# Altium project Wolf-Lite.PrjPcb (part 2 of 2)

## Sheet WL-CONNECT.SchDoc
size 420 x 297 mm; Address1: Address1; Address2: Address2; Address3: Address3; Address4: Address4; DocumentNumber: Wolf-Lite; SheetNumber: 12; Scale: 1:1; DocumentType: Схема электрическая принципиальная; FirstReferrence: АБВГ.123456.001
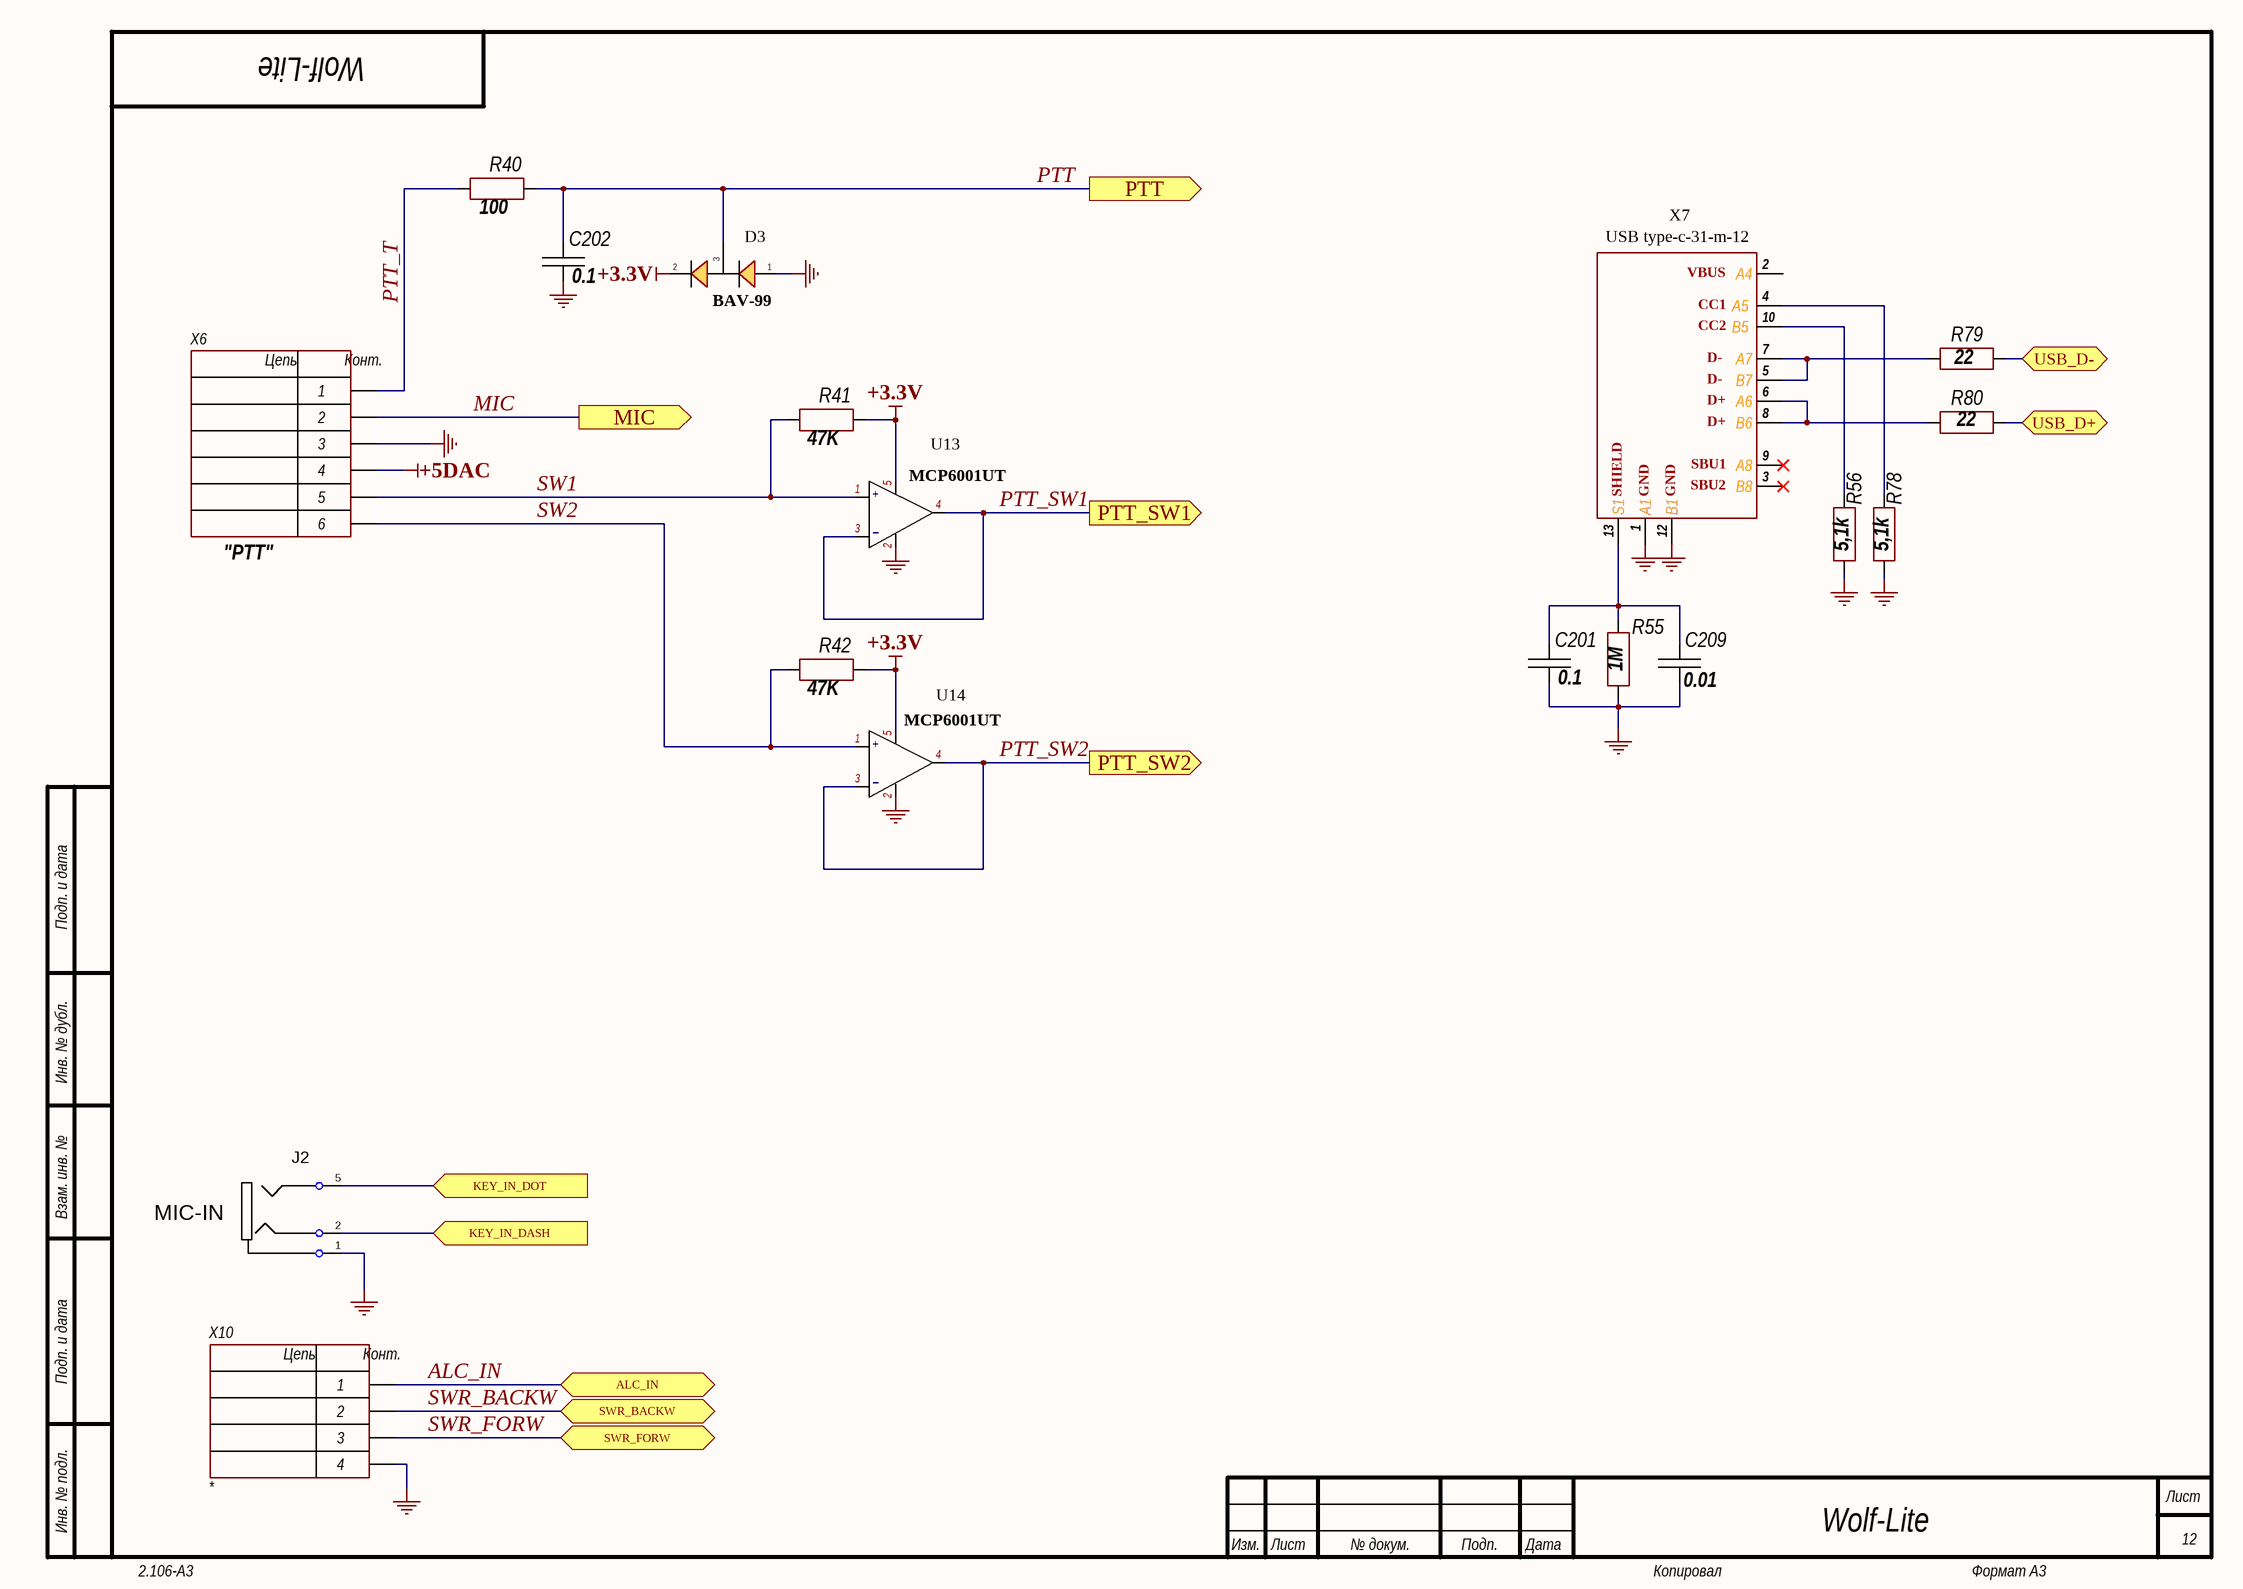
[diagram p10: WL-CONNECT.SchDoc]

### Parts
C201  0.1  [CH0805C]
C202  0.1  [CH0805C]
C209  0.01  [CH0805C]
D3  BAV-99  [SOT23_132]
J2  value MIC-IN  [3.5-stereo]  (hidden comment: SJ1-3525NG)
R40  100  [CH0805R]
R41  47K  [CH0805R]
R42  47K  [CH0805R]
R55  1M  [CH0805R]
R56  5,1k  [CH0805R]
R78  5,1k  [CH0805R]
R79  22  [CH0805R]
R80  22  [CH0805R]
U13  MCP6001UT  [SOT23-5]
U14  MCP6001UT  [SOT23-5]
X6  "PTT"  [RJ25-6pin]
X7  USB type-c-31-m-12  [TYPE-C-31-M-12_V1]
X10  *  [CON: PLS-4]

### Ports
ALC_IN (bidir), KEY_IN_DASH (in), KEY_IN_DOT (in), MIC (out), PTT (out), PTT_SW1 (out), PTT_SW2 (out), SWR_BACKW (bidir), SWR_FORW (bidir), USB_D+ (bidir), USB_D- (bidir)

### Nets
+3.3V: D3.2 R41.2 R42.2 U13.5 U14.5
+5DAC: X6.4
GND: C201.1 C202.1 C209.1 D3.1 J2.1 R55.1 R56.1 R78.1 U13.2 U14.2 X6.3 X7.1(A1) X7.12(B1) X10.4
ALC_IN: X10.1 ; port ALC_IN
KEY_IN_DASH: J2.2 ; port KEY_IN_DASH
KEY_IN_DOT: J2.5 ; port KEY_IN_DOT
MIC: X6.2 ; port MIC
PTT: C202.2 D3.3 R40.2 ; port PTT
PTT_SW1: U13.3 U13.4 ; port PTT_SW1
PTT_SW2: U14.3 U14.4 ; port PTT_SW2
PTT_T: R40.1 X6.1
SW1: R41.1 U13.1 X6.5
SW2: R42.1 U14.1 X6.6
SWR_BACKW: X10.2 ; port SWR_BACKW
SWR_FORW: X10.3 ; port SWR_FORW
USB_D+: R80.2 ; port USB_D+
USB_D-: R79.2 ; port USB_D-
NetC201_2: C201.2 C209.2 R55.2 X7.13(S1)
NetR56_2: R56.2 X7.10(B5)
NetR78_2: R78.2 X7.4(A5)
NetR79_1: R79.1 X7.5(B7) X7.7(A7)
NetR80_1: R80.1 X7.6(A6) X7.8(B6)

Not connected (* = marked no-connect by the designer): X7 2(A4) 3(B8)* 9(A8)*

### Notes on the sheet
- Подп. и дата
- Инв. № дубл.
- Взам. инв. №
- Инв. № подл.
- Изм.
- Лист
- № докум.
- Подп.
- Дата
- 2.106-A3
- Копировал
- Формат А3
- (in symbol 4-Connector) Цепь; Конт.
- (in symbol 6-Connector) Цепь; Конт.
- (in symbol MCP6001UT_1) +; -
- (in symbol USB-C_2.0) VBUS; CC1; CC2; D-; D+; SBU1; SHIELD; GND; SBU2

### Library data of the parts
C201 C202 C209 = Capacitor: Manufacturer: *; Model: *; HelpURL: *; ComponentKind: *; Value: *
J2 = SJ1-3523N
R40-R42 R55 R56 R78-R80 = Resistor: Manufacturer: *; Model: *; HelpURL: *; ComponentKind: *; Value: *
U13 U14 = MCP6001UT_1
X6 = 6-Connector: Model: *; Manufacturer: *; HelpURL: *; ComponentKind: *
X7 = USB-C_2.0
X10 = 4-Connector: Model: *; Manufacturer: *; HelpURL: *; ComponentKind: *

## Sheet WL-BPF_L.SchDoc
size 420 x 297 mm; Address1: Address1; Address2: Address2; Address3: Address3; Address4: Address4; DocumentNumber: Wolf-Lite; SheetNumber: 11; Scale: 1:1; DocumentType: Схема электрическая принципиальная; FirstReferrence: АБВГ.123456.001
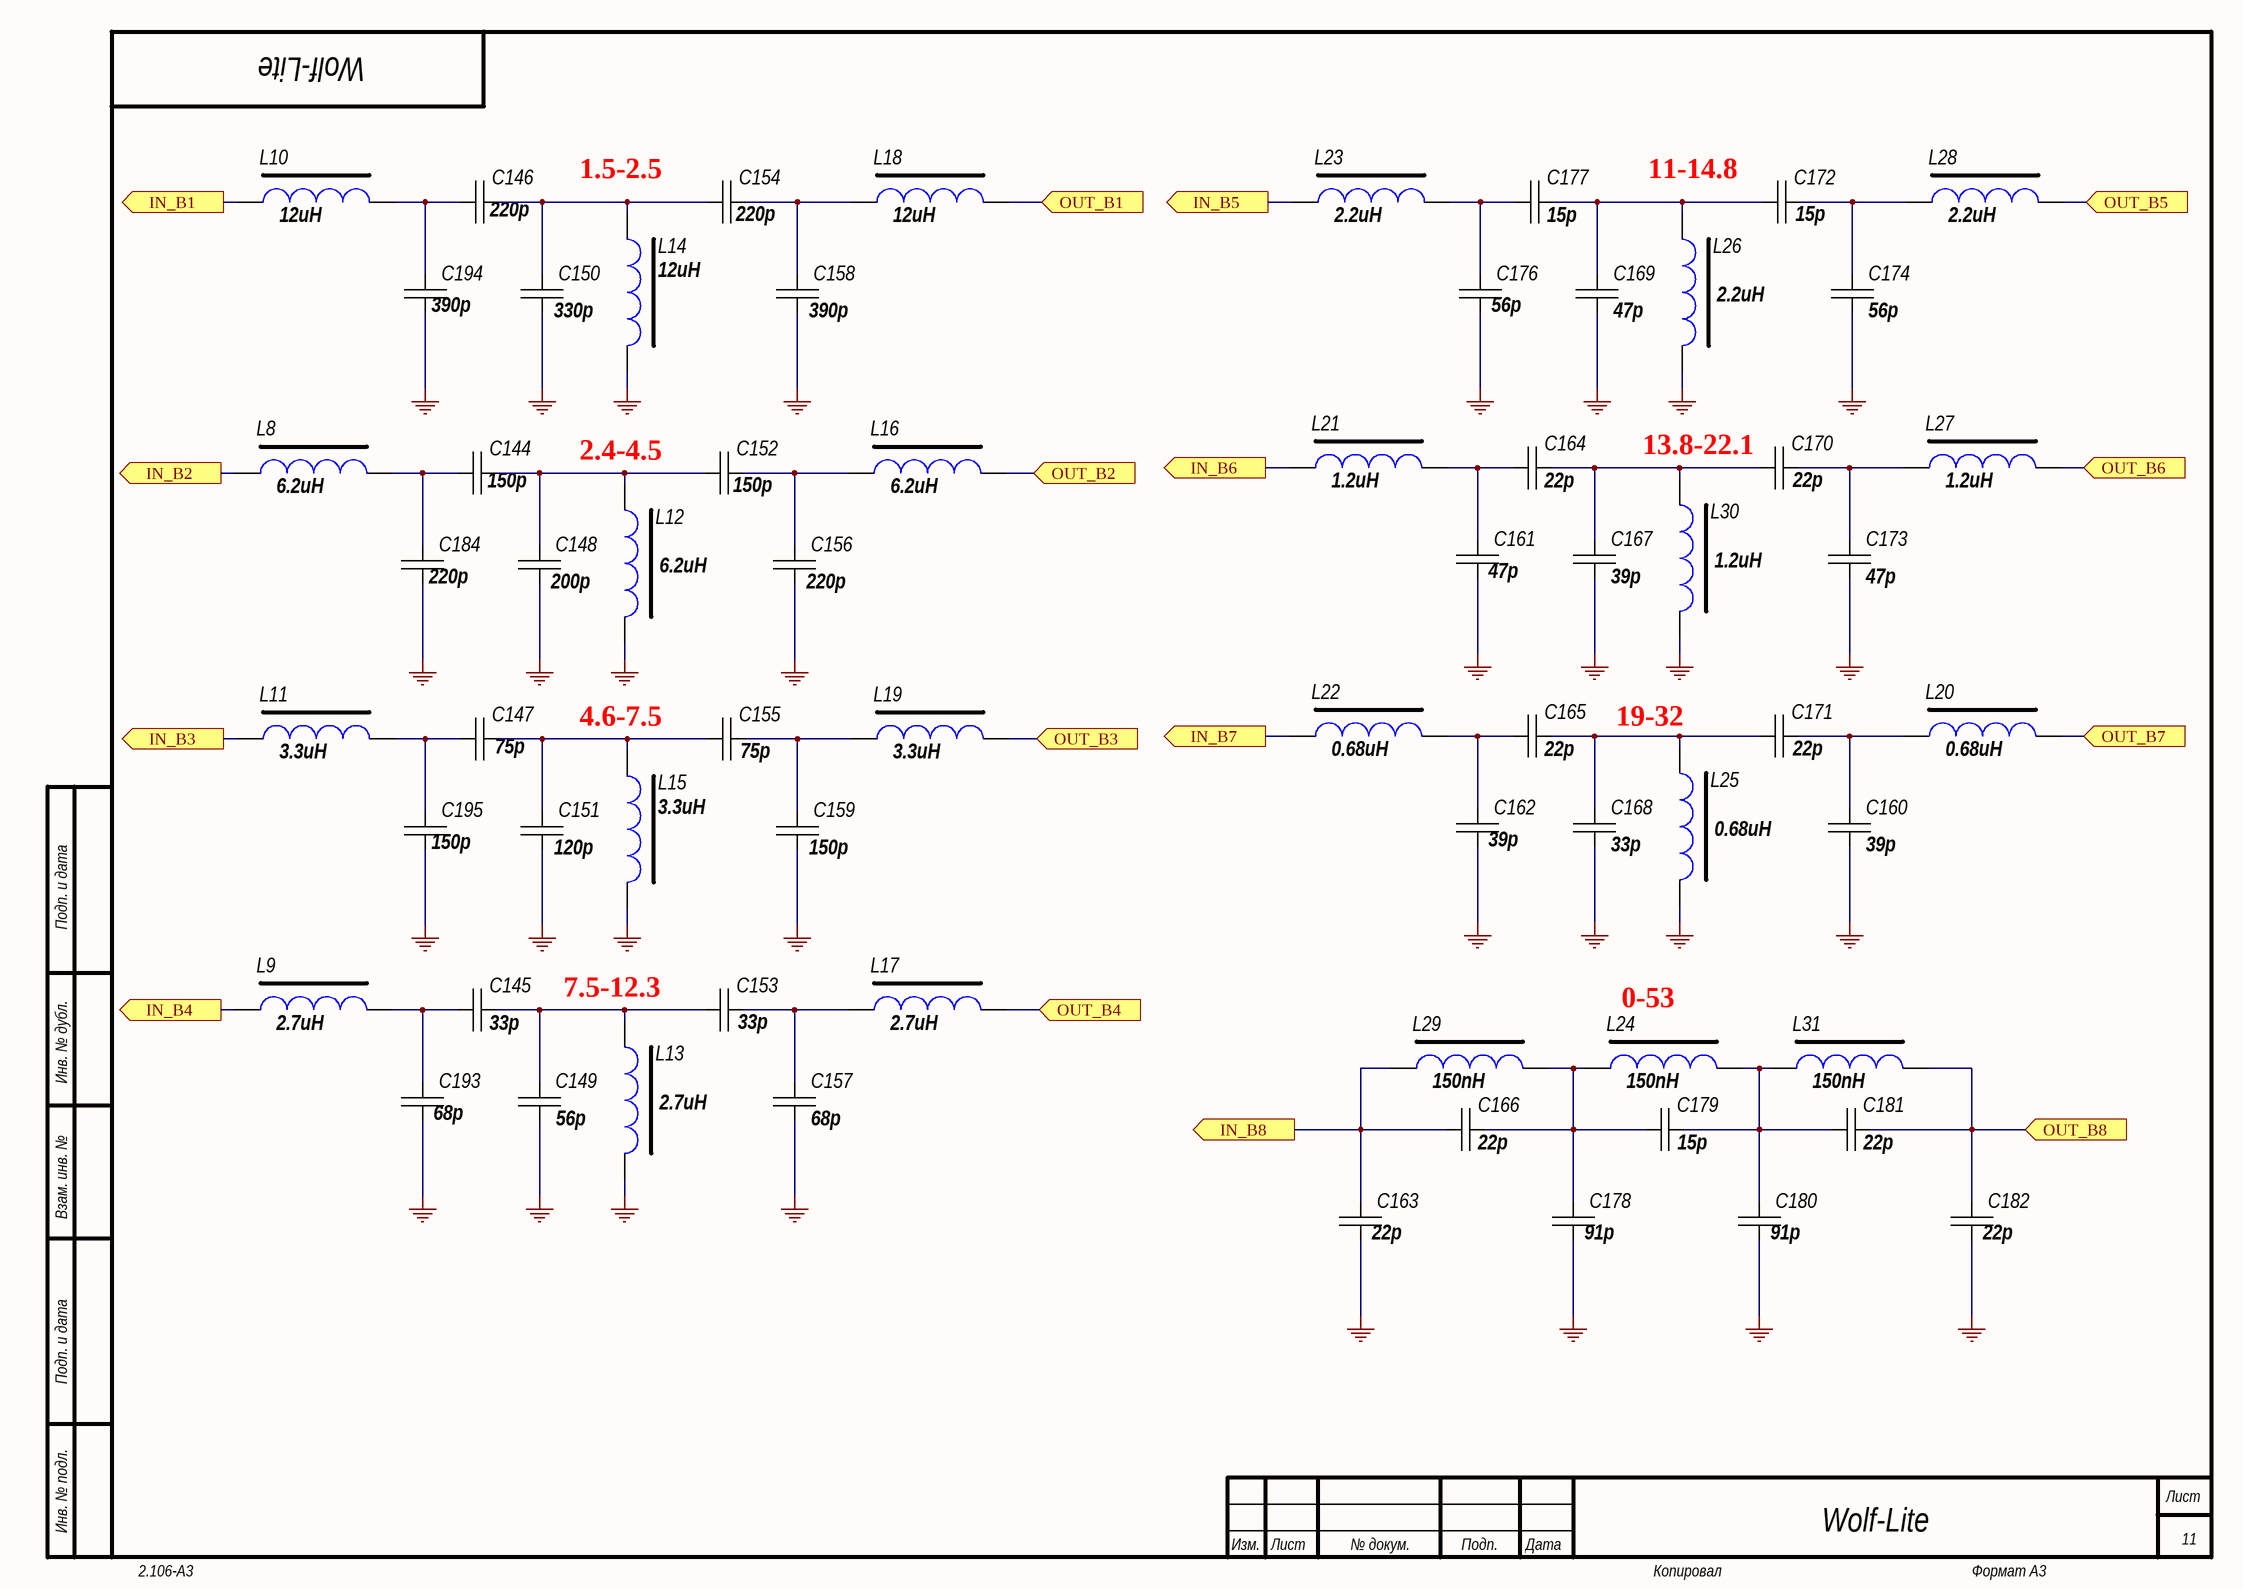
[diagram p11: WL-BPF_L.SchDoc]

### Parts
C144  150p  [CH0805C]
C145  33p  [CH0805C]
C146  220p  [CH0805C]
C147  75p  [CH0805C]
C148  200p  [CH0805C]
C149  56p  [CH0805C]
C150  330p  [CH0805C]
C151  120p  [CH0805C]
C152  150p  [CH0805C]
C153  33p  [CH0805C]
C154  220p  [CH0805C]
C155  75p  [CH0805C]
C156  220p  [CH0805C]
C157  68p  [CH0805C]
C158  390p  [CH0805C]
C159  150p  [CH0805C]
C160  39p  [CH0805C]
C161  47p  [CH0805C]
C162  39p  [CH0805C]
C163  22p  [CH0805C]
C164  22p  [CH0805C]
C165  22p  [CH0805C]
C166  22p  [CH0805C]
C167  39p  [CH0805C]
C168  33p  [CH0805C]
C169  47p  [CH0805C]
C170  22p  [CH0805C]
C171  22p  [CH0805C]
C172  15p  [CH0805C]
C173  47p  [CH0805C]
C174  56p  [CH0805C]
C176  56p  [CH0805C]
C177  15p  [CH0805C]
C178  91p  [CH0805C]
C179  15p  [CH0805C]
C180  91p  [CH0805C]
C181  22p  [CH0805C]
C182  22p  [CH0805C]
C184  220p  [CH0805C]
C193  68p  [CH0805C]
C194  390p  [CH0805C]
C195  150p  [CH0805C]
L8  6.2uH  [L1210]
L9  2.7uH  [L1210]
L10  12uH  [L1210]
L11  3.3uH  [L1210]
L12  6.2uH  [L1210]
L13  2.7uH  [L1210]
L14  12uH  [L1210]
L15  3.3uH  [L1210]
L16  6.2uH  [L1210]
L17  2.7uH  [L1210]
L18  12uH  [L1210]
L19  3.3uH  [L1210]
L20  0.68uH  [L1210]
L21  1.2uH  [L1210]
L22  0.68uH  [L1210]
L23  2.2uH  [L1210]
L24  150nH  [L1210]
L25  0.68uH  [L1210]
L26  2.2uH  [L1210]
L27  1.2uH  [L1210]
L28  2.2uH  [L1210]
L29  150nH  [L1210]
L30  1.2uH  [L1210]
L31  150nH  [L1210]

### Ports
IN_B1 (out), IN_B2 (out), IN_B3 (out), IN_B4 (out), IN_B5 (out), IN_B6 (out), IN_B7 (out), IN_B8 (out), OUT_B1 (in), OUT_B2 (in), OUT_B3 (in), OUT_B4 (in), OUT_B5 (in), OUT_B6 (in), OUT_B7 (in), OUT_B8 (in)

### Nets
GND: C148.1 C149.1 C150.1 C151.1 C156.1 C157.1 C158.1 C159.1 C160.1 C161.1 C162.1 C163.1 C167.1 C168.1 C169.1 C173.1 C174.1 C176.1 C178.1 C180.1 C182.1 C184.1 C193.1 C194.1 C195.1 L12.1 L13.1 L14.1 L15.1 L25.1 L26.1 L30.1
IN_B1: L10.1 ; port IN_B1
IN_B2: L8.1 ; port IN_B2
IN_B3: L11.1 ; port IN_B3
IN_B4: L9.1 ; port IN_B4
IN_B5: L23.1 ; port IN_B5
IN_B6: L21.1 ; port IN_B6
IN_B7: L22.1 ; port IN_B7
IN_B8: C163.2 C166.1 L29.1 ; port IN_B8
OUT_B1: L18.2 ; port OUT_B1
OUT_B2: L16.2 ; port OUT_B2
OUT_B3: L19.2 ; port OUT_B3
OUT_B4: L17.2 ; port OUT_B4
OUT_B5: L28.2 ; port OUT_B5
OUT_B6: L27.2 ; port OUT_B6
OUT_B7: L20.2 ; port OUT_B7
OUT_B8: C181.2 C182.2 L31.2 ; port OUT_B8
NetC144_1: C144.1 C184.2 L8.2
NetC144_2: C144.2 C148.2 C152.1 L12.2
NetC145_1: C145.1 C193.2 L9.2
NetC145_2: C145.2 C149.2 C153.1 L13.2
NetC146_1: C146.1 C194.2 L10.2
NetC146_2: C146.2 C150.2 C154.1 L14.2
NetC147_1: C147.1 C195.2 L11.2
NetC147_2: C147.2 C151.2 C155.1 L15.2
NetC152_2: C152.2 C156.2 L16.1
NetC153_2: C153.2 C157.2 L17.1
NetC154_2: C154.2 C158.2 L18.1
NetC155_2: C155.2 C159.2 L19.1
NetC160_2: C160.2 C171.2 L20.1
NetC161_2: C161.2 C164.1 L21.2
NetC162_2: C162.2 C165.1 L22.2
NetC164_2: C164.2 C167.2 C170.1 L30.2
NetC165_2: C165.2 C168.2 C171.1 L25.2
NetC166_2: C166.2 C178.2 C179.1 L24.1 L29.2
NetC169_2: C169.2 C172.1 C177.2 L26.2
NetC170_2: C170.2 C173.2 L27.1
NetC172_2: C172.2 C174.2 L28.1
NetC176_2: C176.2 C177.1 L23.2
NetC179_2: C179.2 C180.2 C181.1 L24.2 L31.1

### Notes on the sheet
- 1.5-2.5
- (near C172) 11-14.8
- 2.4-4.5
- (near C170) 13.8-22.1
- 4.6-7.5
- (near L25) 19-32
- 7.5-12.3
- (near L24) 0-53
- Подп. и дата
- Инв. № дубл.
- Взам. инв. №
- Инв. № подл.
- Изм.
- Лист
- № докум.
- Подп.
- Дата
- 2.106-A3
- Копировал
- Формат А3

### Library data of the parts
C144-C174 C176-C182 C184 C193-C195 = Capacitor: Manufacturer: *; Model: *; HelpURL: *; ComponentKind: *; Value: *
L8-L31 = TRANS

## Nets that join several sheets
+1.2V: WL-Power (11 pins), WL-FPGA (10 pins)
+2.5V: WL-Power (13 pins), WL-FPGA (U3.35 U3.96 U3.107)
+3.3DAC: WL-Power (C127.1 DA5.2 DA5.4), WL-DAC904 (FB2.2)
+3.3V: WL-Power (18 pins), WL-FPGA (19 pins), WL-ATT (FB7.2), WL-CPU-V1.0 (16 pins), WL-AUDIO (FB5.2 FB6.2 R34.1 R35.1), WL-CONNECT (5 pins)
+3.3VAD: WL-Power (C128.1 DA4.2 DA4.4), WL-AD9226 (FB1.1 L3.2)
+5DAC: WL-Power (5 pins), WL-DAC904 (FB8.2), WL-AUDIO (FB4.2), WL-CONTROL (C185.1 U11.6 U11.16), WL-BPF (FB9.2 FB10.2), WL-CONNECT (X6.4)
+5VAD: WL-Power (C129.1 DA2.2 DA2.4 DA4.3), WL-AD9226 (FB3.2 L4.2), WL-CPU-V1.0 (X12.4)
+8Power: WL-Power (16 pins), WL-DAC904 (FB15.1), WL-CPU-V1.0 (X1.9)
GND: WL-Power (67 pins), WL-AD9226 (49 pins), WL-FPGA (26 pins), WL-DAC904 (30 pins), WL-ATT (18 pins), WL-CPU-V1.0 (23 pins), WL-AUDIO (32 pins), WL-CONTROL (15 pins), WL-BPF (16 pins), WL-CONNECT (14 pins), WL-BPF_L (32 pins)
POWER-ON: WL-Power (6 pins), WL-CPU-V1.0 (R7.2), WL-CONTROL (9 pins)
ALC_IN: WL-CPU-V1.0 (U1.34), WL-CONNECT (X10.1)
ATT_ON_0.5: WL-FPGA (U3.86), WL-ATT (C79.2 U9.20)
ATT_ON_1: WL-FPGA (U3.87), WL-ATT (C80.2 U9.19)
ATT_ON_2: WL-FPGA (U3.98), WL-ATT (C81.2 U9.17)
ATT_ON_4: WL-FPGA (U3.99), WL-ATT (C197.2 U9.16)
ATT_ON_8: WL-FPGA (U3.100), WL-ATT (C198.2 U9.15)
ATT_ON_16: WL-FPGA (U3.85), WL-ATT (C82.2 U9.1)
AUDIO_I2S_CLOCK: WL-FPGA (U3.136), WL-CPU-V1.0 (U1.66), WL-AUDIO (U8.25)
BPF_A: WL-FPGA (U3.80), WL-BPF (5 pins)
BPF_B: WL-FPGA (U3.83), WL-BPF (5 pins)
BPF_OE1: WL-FPGA (U3.77), WL-BPF (5 pins)
BPF_OE2: WL-FPGA (U3.84), WL-BPF (5 pins)
CPU_PW: WL-Power (C175.1 VD1.1), WL-CPU-V1.0 (U1.93)
CPU_PW_HOLD: WL-Power (R50.2 VT1.1), WL-CPU-V1.0 (U1.92)
FPG_CTRL: WL-AD9226 (R63.1), WL-FPGA (U3.143)
FPGA_48K_CLK: WL-FPGA (U3.135), WL-CPU-V1.0 (U1.47)
FPGA_BUS_CLK: WL-FPGA (U3.33), WL-CPU-V1.0 (U1.17)
FPGA_BUS_D0: WL-FPGA (U3.49), WL-CPU-V1.0 (U1.23)
FPGA_BUS_D1: WL-FPGA (U3.50), WL-CPU-V1.0 (U1.24)
FPGA_BUS_D2: WL-FPGA (U3.51), WL-CPU-V1.0 (U1.25)
FPGA_BUS_D3: WL-FPGA (U3.38), WL-CPU-V1.0 (U1.26)
FPGA_BUS_D4: WL-FPGA (U3.39), WL-CPU-V1.0 (U1.29)
FPGA_BUS_D5: WL-FPGA (U3.42), WL-CPU-V1.0 (U1.30)
FPGA_BUS_D6: WL-FPGA (U3.43), WL-CPU-V1.0 (U1.31)
FPGA_BUS_D7: WL-FPGA (U3.46), WL-CPU-V1.0 (U1.32)
FPGA_BUS_SYNC: WL-FPGA (U3.32), WL-CPU-V1.0 (U1.18)
IN_B1: WL-BPF (U10.6 U10.10), WL-BPF_L (L10.1)
IN_B2: WL-BPF (U10.5 U10.11), WL-BPF_L (L8.1)
IN_B3: WL-BPF (U10.4 U10.12), WL-BPF_L (L11.1)
IN_B4: WL-BPF (U10.3 U10.13), WL-BPF_L (L9.1)
IN_B5: WL-BPF (U16.6 U16.10), WL-BPF_L (L23.1)
IN_B6: WL-BPF (U16.5 U16.11), WL-BPF_L (L21.1)
IN_B7: WL-BPF (U16.4 U16.12), WL-BPF_L (L22.1)
IN_B8: WL-BPF (U16.3 U16.13), WL-BPF_L (C163.2 C166.1 L29.1)
IN_LPE: WL-ATT (U9.14), WL-BPF (C192.1)
IN_RX: WL-AD9226 (TR1.4), WL-BPF (C191.1)
KEY_IN_DASH: WL-CPU-V1.0 (U1.97), WL-CONNECT (J2.2)
KEY_IN_DOT: WL-CPU-V1.0 (U1.98), WL-CONNECT (J2.5)
LPF1: WL-FPGA (U3.76), WL-CONTROL (U11.1)
LPF2: WL-FPGA (U3.75), WL-CONTROL (U11.2)
LPF3: WL-FPGA (U3.74), WL-CONTROL (U11.3)
LTC_ENABLE: WL-AD9226 (U4.11), WL-FPGA (U3.69)
MIC: WL-AUDIO (5 pins), WL-CONNECT (X6.2)
Net-bit1: WL-AD9226 (DA9.27), WL-FPGA (U3.52)
Net-bit2: WL-AD9226 (DA9.26), WL-FPGA (U3.53)
Net-bit3: WL-AD9226 (DA9.25), WL-FPGA (U3.54)
Net-bit4: WL-AD9226 (DA9.24), WL-FPGA (U3.55)
Net-bit5: WL-AD9226 (DA9.21), WL-FPGA (U3.58)
Net-bit6: WL-AD9226 (DA9.20), WL-FPGA (U3.59)
Net-bit7: WL-AD9226 (DA9.19), WL-FPGA (U3.60)
Net-bit8: WL-AD9226 (DA9.18), WL-FPGA (U3.64)
Net-bit9: WL-AD9226 (DA9.17), WL-FPGA (U3.65)
Net-bit10: WL-AD9226 (DA9.16), WL-FPGA (U3.66)
Net-bit11: WL-AD9226 (DA9.13), WL-FPGA (U3.67)
Net-bit12: WL-AD9226 (DA9.12), WL-FPGA (U3.68)
Net-Clock: WL-AD9226 (C208.2 DA9.7), WL-FPGA (U3.89)
Net-otr: WL-AD9226 (DA9.28), WL-FPGA (U3.44)
Net_DAC0: WL-FPGA (U3.101), WL-DAC904 (U5.14)
Net_DAC1: WL-FPGA (U3.103), WL-DAC904 (U5.13)
Net_DAC2: WL-FPGA (U3.104), WL-DAC904 (U5.12)
Net_DAC3: WL-FPGA (U3.105), WL-DAC904 (U5.11)
Net_DAC4: WL-FPGA (U3.106), WL-DAC904 (U5.10)
Net_DAC5: WL-FPGA (U3.110), WL-DAC904 (U5.9)
Net_DAC6: WL-FPGA (U3.111), WL-DAC904 (U5.8)
Net_DAC7: WL-FPGA (U3.112), WL-DAC904 (U5.7)
Net_DAC8: WL-FPGA (U3.113), WL-DAC904 (U5.6)
Net_DAC9: WL-FPGA (U3.114), WL-DAC904 (U5.5)
Net_DAC10: WL-FPGA (U3.115), WL-DAC904 (U5.4)
Net_DAC11: WL-FPGA (U3.119), WL-DAC904 (U5.3)
Net_DAC12: WL-FPGA (U3.120), WL-DAC904 (U5.2)
Net_DAC13: WL-FPGA (U3.121), WL-DAC904 (U5.1)
Net_DAC-CLK: WL-FPGA (U3.125), WL-DAC904 (U5.28)
Net_DAC-PD: WL-FPGA (U3.124), WL-DAC904 (R16.2 U5.15)
NetC76_1: WL-ATT (C76.1), WL-CONTROL (K1.2 K1.7)
NetK1_4: WL-DAC904 (TR4.3), WL-CONTROL (K1.4 K1.5)
NetR52_1: WL-Power (R52.1 VD1.2 VD2.2), WL-CPU-V1.0 (X1.1)
NetU1_64: WL-CPU-V1.0 (U1.64), WL-AUDIO (U7.5)
OUT_B1: WL-BPF (U17.6 U17.10), WL-BPF_L (L18.2)
OUT_B2: WL-BPF (U17.5 U17.11), WL-BPF_L (L16.2)
OUT_B3: WL-BPF (U17.4 U17.12), WL-BPF_L (L19.2)
OUT_B4: WL-BPF (U17.3 U17.13), WL-BPF_L (L17.2)
OUT_B5: WL-BPF (U18.6 U18.10), WL-BPF_L (L28.2)
OUT_B6: WL-BPF (U18.5 U18.11), WL-BPF_L (L27.2)
OUT_B7: WL-BPF (U18.4 U18.12), WL-BPF_L (L20.2)
OUT_B8: WL-BPF (U18.3 U18.13), WL-BPF_L (C181.2 C182.2 L31.2)
PTT: WL-CPU-V1.0 (U1.37), WL-CONNECT (C202.2 D3.3 R40.2)
PTT_SW1: WL-CPU-V1.0 (U1.35), WL-CONNECT (U13.3 U13.4)
PTT_SW2: WL-CPU-V1.0 (U1.36), WL-CONNECT (U14.3 U14.4)
RX/TX: WL-FPGA (U3.72), WL-DAC904 (R75.1), WL-CONTROL (R13.2 R39.2 R71.1)
SWR_BACKW: WL-CPU-V1.0 (U1.16), WL-CONNECT (X10.2)
SWR_FORW: WL-CPU-V1.0 (U1.15), WL-CONNECT (X10.3)
USB_D+: WL-CPU-V1.0 (U1.71), WL-CONNECT (R80.2)
USB_D-: WL-CPU-V1.0 (U1.70), WL-CONNECT (R79.2)
WM8731_ADC_SD: WL-CPU-V1.0 (U1.79), WL-AUDIO (U8.6)
WM8731_BCLK: WL-CPU-V1.0 (U1.78), WL-AUDIO (U8.3)
WM8731_DAC_SD: WL-CPU-V1.0 (U1.80), WL-AUDIO (U8.4)
WM8731_SCK: WL-CPU-V1.0 (U1.84), WL-AUDIO (R34.2 U8.24)
WM8731_SDA: WL-CPU-V1.0 (U1.87), WL-AUDIO (R35.2 U8.23)
WM8731_WS_LRC: WL-CPU-V1.0 (U1.77), WL-AUDIO (U8.5 U8.7)